# Altium schematic sheet MCU.SchDoc
size Letter; SheetNumber: 1; SheetTotal: 2
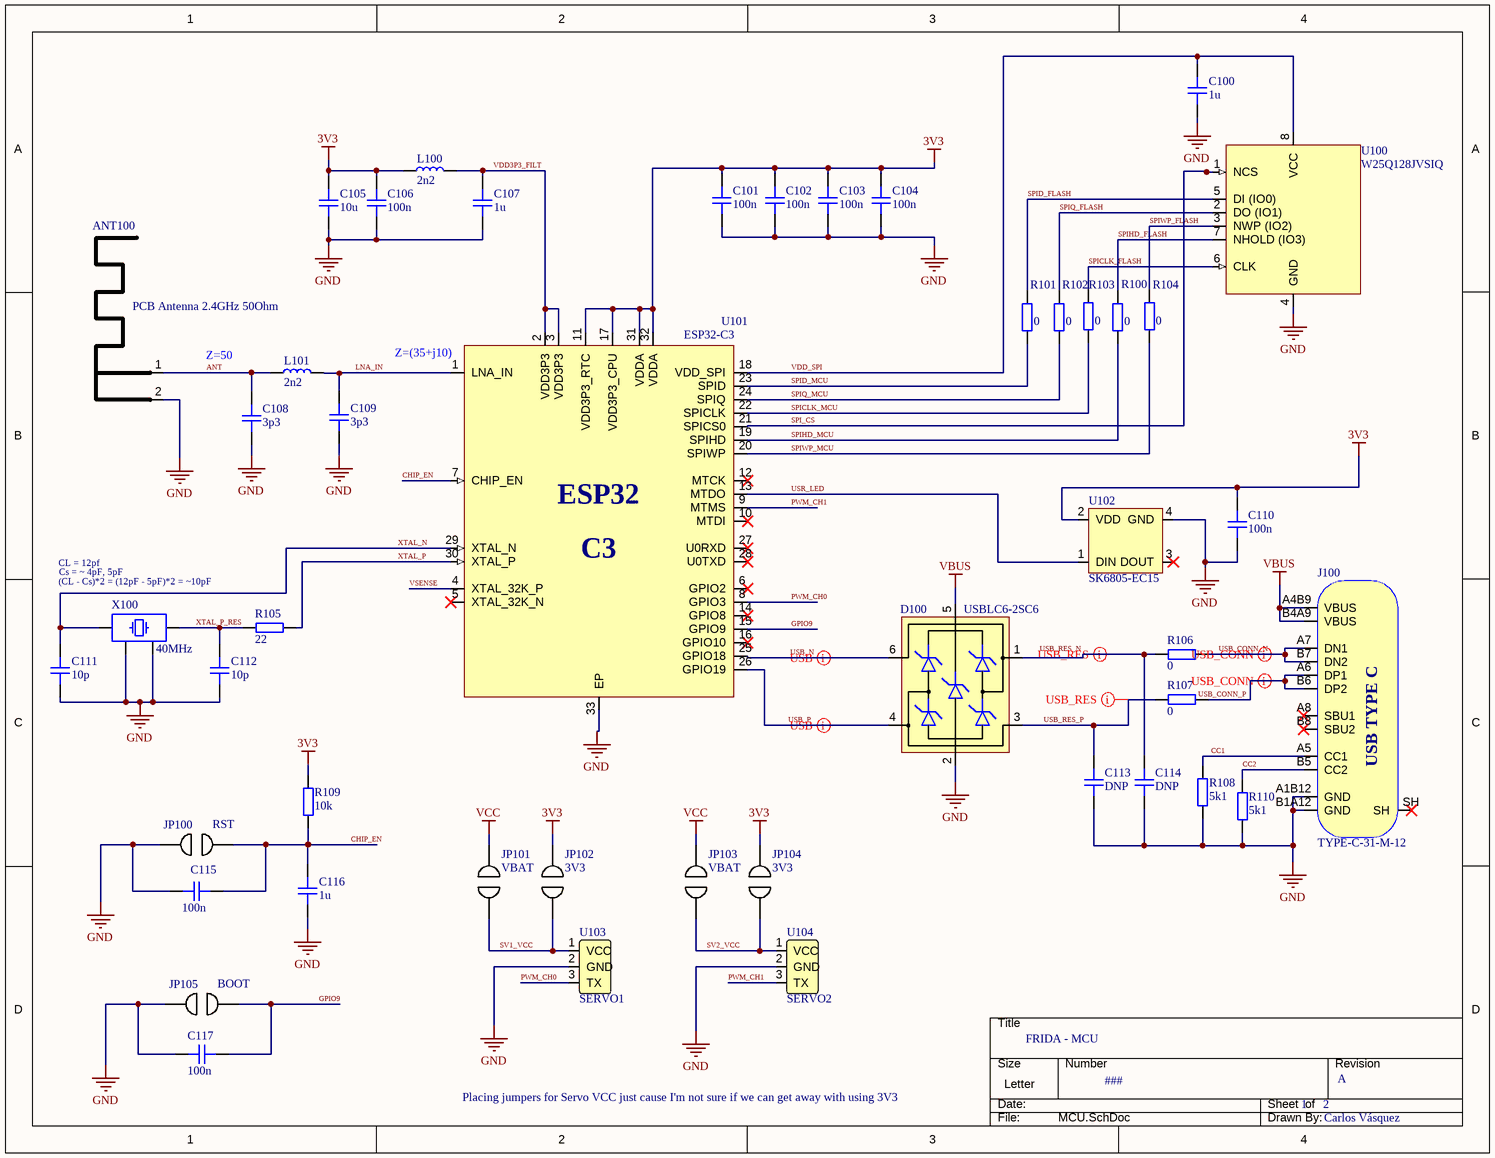
[diagram p0: MCU.SchDoc]

## Parts
ANT100  PCB Antenna 2.4GHz 50Ohm  [ANT_IFA_USB_2_4GHZ_50R]  (no BOM)
C100  1u  [CAP_0402]
C101  100n  [CAP_0402]
C102  100n  [CAP_0402]
C103  100n  [CAP_0402]
C104  100n  [CAP_0402]
C105  10u  [CAP_0603]
C106  100n  [CAP_0402]
C107  1u  [CAP_0402]
C108  3p3  [CAP_0402]
C109  3p3  [CAP_0402]
C110  100n  [CAP_0402]
C111  10p  [CAP_0402]
C112  10p  [CAP_0402]
C113  DNP  [CAP_0603]
C114  DNP  [CAP_0603]
C115  100n  [CAP_0402]
C116  1u  [CAP_0402]
C117  100n  [CAP_0402]
D100  USBLC6-2SC6  [SOT-23-6]
J100  TYPE-C-31-M-12  [TYPE-C-31-M-12]
JP100  RST  [SOLDER JUMPER BRIDGE]
JP101  VBAT  [SOLDER JUMPER BRIDGE]
JP102  3V3  [SOLDER JUMPER BRIDGE]
JP103  VBAT  [SOLDER JUMPER BRIDGE]
JP104  3V3  [SOLDER JUMPER BRIDGE]
JP105  BOOT  [SOLDER JUMPER BRIDGE]
L100  2n2  [IND_0402]
L101  2n2  [IND_0402]
R100  0  [RES_0402]
R101  0  [RES_0402]
R102  0  [RES_0402]
R103  0  [RES_0402]
R104  0  [RES_0402]
R105  22  [RES_0402]
R106  0  [RES_0402]
R107  0  [RES_0402]
R108  5k1  [RES_0402]
R109  10k  [RES_0402]
R110  5k1  [RES_0402]
U100  W25Q128JVSIQ  [SOIC8_208 mil]
U101  ESP32-C3  [QFN32-5x5]
U102  SK6805-EC15  [SK6805-EC15]
U103  SERVO1  [GPS UART HEADER]
U104  SERVO2  [GPS UART HEADER]
X100  40MHz  [XTAL_3225]

## Nets
3V3: C101.1 C102.1 C103.1 C104.1 C105.1 C106.1 C110.2 JP102.2 JP104.2 L100.1 R109.2 U101.11(VDD3P3_RTC) U101.17(VDD3P3_CPU) U101.31(VDDA) U101.32(VDDA) U102.2(VDD)
GND: ANT100.2(GND) C100.1 C101.2 C102.2 C103.2 C104.2 C105.2 C106.2 C107.1 C108.1 C109.1 C110.1 C111.2 C112.2 C113.1 C114.1 C115.2 C116.1 C117.2 D100.2(GND) J100.A1B12(GND) J100.B1A12(GND) JP100.1 JP105.1 R108.1 R110.1 U100.4(GND) U101.33(EP) U102.4(GND) U103.2(GND) U104.2(GND) X100.2 X100.4
VBUS: D100.5(VBUS) J100.A4B9(VBUS) J100.B4A9(VBUS)
VCC: JP101.2 JP103.2
ANT: ANT100.1(RF) C108.2 L101.1
CC1: J100.A5(CC1) R108.2
CC2: J100.B5(CC2) R110.2
CHIP_EN: C115.1 C116.2 JP100.2 R109.1 U101.7(CHIP_EN)
GPIO9: C117.1 JP105.2 U101.15(GPIO9)
LNA_IN: C109.2 L101.2 U101.1(LNA_IN)
PWM_CH0: U101.8(GPIO3) U103.3(TX)
PWM_CH1: U101.9(MTMS) U104.3(TX)
SPI_CS: U100.1(NCS) U101.21(SPICS0)
SPICLK_FLASH: R103.2 U100.6(CLK)
SPICLK_MCU: R103.1 U101.22(SPICLK)
SPID_FLASH: R101.2 U100.5(DI_(IO0))
SPID_MCU: R101.1 U101.23(SPID)
SPIHD_FLASH: R100.2 U100.7(NHOLD_(IO3))
SPIHD_MCU: R100.1 U101.19(SPIHD)
SPIQ_FLASH: R102.2 U100.2(DO_(IO1))
SPIQ_MCU: R102.1 U101.24(SPIQ)
SPIWP_FLASH: R104.2 U100.3(NWP_(IO2))
SPIWP_MCU: R104.1 U101.20(SPIWP)
SV1_VCC: JP101.1 JP102.1 U103.1(VCC)
SV2_VCC: JP103.1 JP104.1 U104.1(VCC)
USB_CONN_N: J100.A7(DN1) J100.B7(DN2) R106.2
USB_CONN_P: J100.A6(DP1) J100.B6(DP2) R107.2
USB_N: D100.6(IO1) U101.25(GPIO18)
USB_P: D100.4(IO2) U101.26(GPIO19)
USB_RES_N: C114.2 D100.1(IO1) R106.1
USB_RES_P: C113.2 D100.3(IO2) R107.1
USR_LED: U101.13(MTDO) U102.1(DIN)
VDD3P3_FILT: C107.2 L100.2 U101.2(VDD3P3) U101.3(VDD3P3)
VDD_SPI: C100.2 U100.8(VCC) U101.18(VDD_SPI)
VSENSE: U101.4(XTAL_32K_P)
XTAL_N: C111.1 U101.29(XTAL_N) X100.1
XTAL_P: R105.2 U101.30(XTAL_P)
XTAL_P_RES: C112.1 R105.1 X100.3

Not connected (* = marked no-connect by the designer): J100 A8(SBU1)* B8(SBU2)* SH*; U101 5(XTAL_32K_N)* 6(GPIO2)* 10(MTDI)* 12(MTCK)* 14(GPIO8)* 16(GPIO10)* 27(U0RXD)* 28(U0TXD)*; U102 3(DOUT)*

## Layout directives
differential pair: USB_CONN_N, USB_CONN_P, USB_N, USB_P, USB_RES_N, USB_RES_P

## Notes on the sheet
- Z=50
- (near U101) Z=(35+j10)
- CL = 12pf
- (near X100) Cs = ~ 4pF, 5pF
- (CL - Cs)*2 = (12pF - 5pF)*2 = ~10pF
- FRIDA - MCU
- Placing jumpers for Servo VCC just cause I'm not sure if we can get away with using 3V3
- ###
- 1
- 2
- A
- Carlos Vásquez
- DWG. NO.
- REV.
- SHT.
- REVISION
- DESCRIPTION
- DATE
- APPROVED
- THIS DOCUMENT AND THE DATA DISCLOSED HEREIN OR HEREWITH IS THE PROPERTY OF ALTIUM LIMITED AND MAY BE FREELY DISTRIBUTED IN WHOLE. NO RIGHTS ARE RESERVED OR EXPRESS OR IMPLIED WARANTEE GIVEN.
- ENG:
- DSN:
- APPROVALS
- PROJECT
- DOCUMENT REVISION:
- DESIGN ITEM:
- CHK:
- BOM:
- REFERENCE DOCUMENTS
- PROJECT REVISION:
- TITLE
- FAB DWG:
- PCB DWG:
- ASSY DWG:
- SCALE:
- SIZE
- C
- CAGE CODE
- FILE NAME
- DWG NO.
- SHEET
- OF
- REV
- (in symbol ESP32-C3) ESP32; C3
- (in symbol TYPE-C-31-M-12) USB TYPE C

## Library data of the parts
ANT100 = ANT_IFA_USB_2_4GHZ_50R: Inverted F 2.4GHz ISM PCB Antenna 50 Ohm; ComponentLink1Description: Datasheet; ComponentLink1URL: https://www.ti.com/lit/an/swra117d/swra117d.pdf
C100-C104 C106-C112 C115-C117 = CAP_0402: Capacitor SMD 0402; Manufacturer: *; Manufacturer Part Number: *; Distributor Link: *; LCSC: *; Rating: *; Dielectric: *
C105 C113 C114 = CAP_0603: Capacitor SMD 0603; Manufacturer: *; Manufacturer Part Number: *; Distributor Link: *; LCSC: *; Rating: *; Dielectric: *
D100 = USBLC6-2SC6: Low-Capacitance ESD Protection USB; Manufacturer: STMicroelectronics; Manufacturer Part Number: USBLC6-2SC6; Distributor Link: https://www.mouser.de/ProductDetail/STMicroelectronics/USBLC6-2SC6?qs=po45yt2pPpu%2FhNIlwQdTlg%3D%3D
J100 = TYPE-C-31-M-12: USB Type C Connector Horizontal SMT; Manufacturer: Koren Hroparts; Manufacturer Part Number: TYPE-C-31-M-12
JP100-JP105 = SOLDER BRIDGE: Solder Jumper Bridge
L100 L101 = IND_0402: Inductor SMD 0402
R100-R110 = RES_0402: Resistor SMD 0402; Manufacturer: *; Manufacturer Part Number: *; Distributor Link: *; LCSC: *
U100 = W25Q128JVSIQ: 128M-BIT / SERIAL FLASH MEMORY WITH / DUAL/QUAD SPI & QPI & DTR SOIC-8 208 MIL; Manufacturer: Winbond; Manufacturer Part Number: W25Q128JVSIM
U101 = ESP32-C3: Ultra­Low­Power SoC with RISC­V Single­Core CPU Supporting IEEE 802.11b/g/n (2.4 GHz Wi­Fi) and Bluetooth® 5 (LE); Manufacturer: Espressif; Manufacturer Part Number: ESP32-C3; LCSC: C2838500
U103 U104 = UART GPS: UART GPS (3 pin breakout)
X100 = TSX-3225_24.0000MF15X-AC: Crystal SMD 40MHz 10PPM 12pF 3225; Manufacturer: Epson; Manufacturer Part Number: TSX-3225 24.0000MF15X-AC